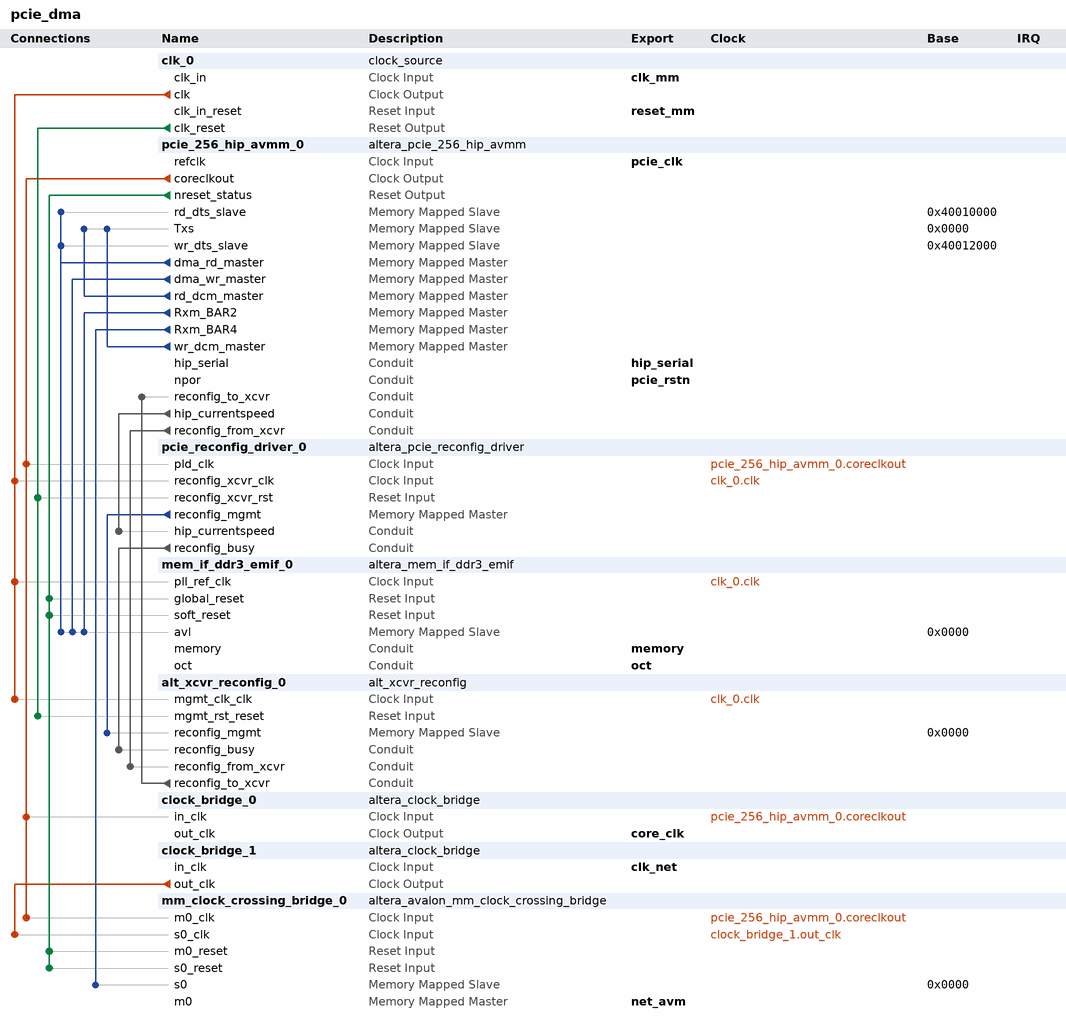
[diagram p0: system contents]
# Platform Designer (Qsys) system pcie_dma, Stratix V 5SGXEA7N2F45C2
# Parameters at their usual value, and those the tool derives, are not listed.
package require -exact qsys 14.0
create_system pcie_dma
set_project_property DEVICE_FAMILY {Stratix V}
set_project_property DEVICE 5SGXEA7N2F45C2

add_instance clk_0 clock_source 14.0
set_instance_parameter_value clk_0 clockFrequency 50000000

add_instance pcie_256_hip_avmm_0 altera_pcie_256_hip_avmm 14.0
set_instance_parameter_value pcie_256_hip_avmm_0 pcie_qsys 1
set_instance_parameter_value pcie_256_hip_avmm_0 lane_mask_hwtcl x8
set_instance_parameter_value pcie_256_hip_avmm_0 gen123_lane_rate_mode_hwtcl {Gen2 (5.0 Gbps)}
set_instance_parameter_value pcie_256_hip_avmm_0 app_interface_width_hwtcl 128
set_instance_parameter_value pcie_256_hip_avmm_0 port_type_hwtcl {Native endpoint}
set_instance_parameter_value pcie_256_hip_avmm_0 rxbuffer_rxreq_hwtcl Low
set_instance_parameter_value pcie_256_hip_avmm_0 pll_refclk_freq_hwtcl {100 MHz}
set_instance_parameter_value pcie_256_hip_avmm_0 set_pld_clk_x1_625MHz_hwtcl 0
set_instance_parameter_value pcie_256_hip_avmm_0 internal_controller_hwtcl 1
set_instance_parameter_value pcie_256_hip_avmm_0 enable_cra_hwtcl 1
set_instance_parameter_value pcie_256_hip_avmm_0 enable_rxm_burst_hwtcl 0
set_instance_parameter_value pcie_256_hip_avmm_0 in_cvp_mode_hwtcl 0
set_instance_parameter_value pcie_256_hip_avmm_0 enable_tl_only_sim_hwtcl 0
set_instance_parameter_value pcie_256_hip_avmm_0 use_atx_pll_hwtcl 0
set_instance_parameter_value pcie_256_hip_avmm_0 hip_tag_checking_hwtcl 1
set_instance_parameter_value pcie_256_hip_avmm_0 enable_power_on_rst_pulse_hwtcl 0
set_instance_parameter_value pcie_256_hip_avmm_0 enable_pcisigtest_hwtcl 0
set_instance_parameter_value pcie_256_hip_avmm_0 SLAVE_ADDRESS_MAP_0 0
set_instance_parameter_value pcie_256_hip_avmm_0 SLAVE_ADDRESS_MAP_1 0
set_instance_parameter_value pcie_256_hip_avmm_0 SLAVE_ADDRESS_MAP_2 30
set_instance_parameter_value pcie_256_hip_avmm_0 SLAVE_ADDRESS_MAP_3 0
set_instance_parameter_value pcie_256_hip_avmm_0 SLAVE_ADDRESS_MAP_4 26
set_instance_parameter_value pcie_256_hip_avmm_0 SLAVE_ADDRESS_MAP_5 0
set_instance_parameter_value pcie_256_hip_avmm_0 RD_SLAVE_ADDRESS_MAP 31
set_instance_parameter_value pcie_256_hip_avmm_0 WR_SLAVE_ADDRESS_MAP 30
set_instance_parameter_value pcie_256_hip_avmm_0 NUM_PREFETCH_MASTERS 1
set_instance_parameter_value pcie_256_hip_avmm_0 bar0_type_hwtcl 64
set_instance_parameter_value pcie_256_hip_avmm_0 bar1_type_hwtcl 1
set_instance_parameter_value pcie_256_hip_avmm_0 bar2_type_hwtcl 64
set_instance_parameter_value pcie_256_hip_avmm_0 bar3_type_hwtcl 1
set_instance_parameter_value pcie_256_hip_avmm_0 bar4_type_hwtcl 32
set_instance_parameter_value pcie_256_hip_avmm_0 bar5_type_hwtcl 1
set_instance_parameter_value pcie_256_hip_avmm_0 CB_P2A_AVALON_ADDR_B0 0x00000000
set_instance_parameter_value pcie_256_hip_avmm_0 CB_P2A_AVALON_ADDR_B1 0x00000000
set_instance_parameter_value pcie_256_hip_avmm_0 CB_P2A_AVALON_ADDR_B2 0x00000000
set_instance_parameter_value pcie_256_hip_avmm_0 CB_P2A_AVALON_ADDR_B3 0x00000000
set_instance_parameter_value pcie_256_hip_avmm_0 CB_P2A_AVALON_ADDR_B4 0x00000000
set_instance_parameter_value pcie_256_hip_avmm_0 CB_P2A_AVALON_ADDR_B5 0x00000000
set_instance_parameter_value pcie_256_hip_avmm_0 fixed_address_mode 0
set_instance_parameter_value pcie_256_hip_avmm_0 CB_P2A_FIXED_AVALON_ADDR_B0 0
set_instance_parameter_value pcie_256_hip_avmm_0 CB_P2A_FIXED_AVALON_ADDR_B1 0
set_instance_parameter_value pcie_256_hip_avmm_0 CB_P2A_FIXED_AVALON_ADDR_B2 0
set_instance_parameter_value pcie_256_hip_avmm_0 CB_P2A_FIXED_AVALON_ADDR_B3 0
set_instance_parameter_value pcie_256_hip_avmm_0 CB_P2A_FIXED_AVALON_ADDR_B4 0
set_instance_parameter_value pcie_256_hip_avmm_0 CB_P2A_FIXED_AVALON_ADDR_B5 0
set_instance_parameter_value pcie_256_hip_avmm_0 vendor_id_hwtcl 4466
set_instance_parameter_value pcie_256_hip_avmm_0 device_id_hwtcl 57347
set_instance_parameter_value pcie_256_hip_avmm_0 revision_id_hwtcl 1
set_instance_parameter_value pcie_256_hip_avmm_0 class_code_hwtcl 0
set_instance_parameter_value pcie_256_hip_avmm_0 subsystem_vendor_id_hwtcl 0
set_instance_parameter_value pcie_256_hip_avmm_0 subsystem_device_id_hwtcl 10337
set_instance_parameter_value pcie_256_hip_avmm_0 max_payload_size_hwtcl 256
set_instance_parameter_value pcie_256_hip_avmm_0 extend_tag_field_hwtcl 32
set_instance_parameter_value pcie_256_hip_avmm_0 completion_timeout_hwtcl NONE
set_instance_parameter_value pcie_256_hip_avmm_0 enable_completion_timeout_disable_hwtcl 1
set_instance_parameter_value pcie_256_hip_avmm_0 use_aer_hwtcl 0
set_instance_parameter_value pcie_256_hip_avmm_0 ecrc_check_capable_hwtcl 0
set_instance_parameter_value pcie_256_hip_avmm_0 ecrc_gen_capable_hwtcl 0
set_instance_parameter_value pcie_256_hip_avmm_0 use_crc_forwarding_hwtcl 0
set_instance_parameter_value pcie_256_hip_avmm_0 port_link_number_hwtcl 1
set_instance_parameter_value pcie_256_hip_avmm_0 dll_active_report_support_hwtcl 0
set_instance_parameter_value pcie_256_hip_avmm_0 surprise_down_error_support_hwtcl 0
set_instance_parameter_value pcie_256_hip_avmm_0 slotclkcfg_hwtcl 1
set_instance_parameter_value pcie_256_hip_avmm_0 msi_multi_message_capable_hwtcl 1
set_instance_parameter_value pcie_256_hip_avmm_0 msi_64bit_addressing_capable_hwtcl true
set_instance_parameter_value pcie_256_hip_avmm_0 msi_masking_capable_hwtcl false
set_instance_parameter_value pcie_256_hip_avmm_0 msi_support_hwtcl true
set_instance_parameter_value pcie_256_hip_avmm_0 enable_function_msix_support_hwtcl 0
set_instance_parameter_value pcie_256_hip_avmm_0 msix_table_size_hwtcl 0
set_instance_parameter_value pcie_256_hip_avmm_0 msix_table_offset_hwtcl 0
set_instance_parameter_value pcie_256_hip_avmm_0 msix_table_bir_hwtcl 0
set_instance_parameter_value pcie_256_hip_avmm_0 msix_pba_offset_hwtcl 0
set_instance_parameter_value pcie_256_hip_avmm_0 msix_pba_bir_hwtcl 0
set_instance_parameter_value pcie_256_hip_avmm_0 enable_slot_register_hwtcl 0
set_instance_parameter_value pcie_256_hip_avmm_0 slot_power_scale_hwtcl 0
set_instance_parameter_value pcie_256_hip_avmm_0 slot_power_limit_hwtcl 0
set_instance_parameter_value pcie_256_hip_avmm_0 slot_number_hwtcl 0
set_instance_parameter_value pcie_256_hip_avmm_0 endpoint_l0_latency_hwtcl 0
set_instance_parameter_value pcie_256_hip_avmm_0 endpoint_l1_latency_hwtcl 0
set_instance_parameter_value pcie_256_hip_avmm_0 CG_COMMON_CLOCK_MODE 1
set_instance_parameter_value pcie_256_hip_avmm_0 avmm_width_hwtcl 256
set_instance_parameter_value pcie_256_hip_avmm_0 CG_RXM_IRQ_NUM 16
set_instance_parameter_value pcie_256_hip_avmm_0 TX_S_ADDR_WIDTH 64
set_instance_parameter_value pcie_256_hip_avmm_0 generate_sdc_for_qsys_design_example 0
set_instance_parameter_value pcie_256_hip_avmm_0 use_rx_st_be_hwtcl 0
set_instance_parameter_value pcie_256_hip_avmm_0 use_ast_parity 0
set_instance_parameter_value pcie_256_hip_avmm_0 add_pll_to_hip_coreclkout 0
set_instance_parameter_value pcie_256_hip_avmm_0 set_pll_coreclkout_slack 10
set_instance_parameter_value pcie_256_hip_avmm_0 hip_reconfig_hwtcl 0
set_instance_parameter_value pcie_256_hip_avmm_0 vsec_id_hwtcl 40960
set_instance_parameter_value pcie_256_hip_avmm_0 vsec_rev_hwtcl 0
set_instance_parameter_value pcie_256_hip_avmm_0 expansion_base_address_register_hwtcl 0
set_instance_parameter_value pcie_256_hip_avmm_0 io_window_addr_width_hwtcl 0
set_instance_parameter_value pcie_256_hip_avmm_0 prefetchable_mem_window_addr_width_hwtcl 0
set_instance_parameter_value pcie_256_hip_avmm_0 advanced_default_parameter_override 0
set_instance_parameter_value pcie_256_hip_avmm_0 override_tbpartner_driver_setting_hwtcl 0
set_instance_parameter_value pcie_256_hip_avmm_0 override_rxbuffer_cred_preset 0
set_instance_parameter_value pcie_256_hip_avmm_0 gen3_rxfreqlock_counter_hwtcl 0
set_instance_parameter_value pcie_256_hip_avmm_0 force_hrc 0
set_instance_parameter_value pcie_256_hip_avmm_0 force_src 0
set_instance_parameter_value pcie_256_hip_avmm_0 serial_sim_hwtcl 1
set_instance_parameter_value pcie_256_hip_avmm_0 advanced_default_hwtcl_bypass_cdc false
set_instance_parameter_value pcie_256_hip_avmm_0 advanced_default_hwtcl_enable_rx_buffer_checking false
set_instance_parameter_value pcie_256_hip_avmm_0 advanced_default_hwtcl_disable_link_x2_support false
set_instance_parameter_value pcie_256_hip_avmm_0 advanced_default_hwtcl_wrong_device_id disable
set_instance_parameter_value pcie_256_hip_avmm_0 advanced_default_hwtcl_data_pack_rx disable
set_instance_parameter_value pcie_256_hip_avmm_0 advanced_default_hwtcl_ltssm_1ms_timeout disable
set_instance_parameter_value pcie_256_hip_avmm_0 advanced_default_hwtcl_ltssm_freqlocked_check disable
set_instance_parameter_value pcie_256_hip_avmm_0 advanced_default_hwtcl_deskew_comma com_deskw
set_instance_parameter_value pcie_256_hip_avmm_0 advanced_default_hwtcl_device_number 0
set_instance_parameter_value pcie_256_hip_avmm_0 advanced_default_hwtcl_pipex1_debug_sel disable
set_instance_parameter_value pcie_256_hip_avmm_0 advanced_default_hwtcl_pclk_out_sel pclk
set_instance_parameter_value pcie_256_hip_avmm_0 advanced_default_hwtcl_no_soft_reset false
set_instance_parameter_value pcie_256_hip_avmm_0 advanced_default_hwtcl_maximum_current 0
set_instance_parameter_value pcie_256_hip_avmm_0 advanced_default_hwtcl_d1_support false
set_instance_parameter_value pcie_256_hip_avmm_0 advanced_default_hwtcl_d2_support false
set_instance_parameter_value pcie_256_hip_avmm_0 advanced_default_hwtcl_d0_pme false
set_instance_parameter_value pcie_256_hip_avmm_0 advanced_default_hwtcl_d1_pme false
set_instance_parameter_value pcie_256_hip_avmm_0 advanced_default_hwtcl_d2_pme false
set_instance_parameter_value pcie_256_hip_avmm_0 advanced_default_hwtcl_d3_hot_pme false
set_instance_parameter_value pcie_256_hip_avmm_0 advanced_default_hwtcl_d3_cold_pme false
set_instance_parameter_value pcie_256_hip_avmm_0 advanced_default_hwtcl_low_priority_vc single_vc
set_instance_parameter_value pcie_256_hip_avmm_0 advanced_default_hwtcl_disable_snoop_packet false
set_instance_parameter_value pcie_256_hip_avmm_0 advanced_default_hwtcl_enable_l1_aspm false
set_instance_parameter_value pcie_256_hip_avmm_0 advanced_default_hwtcl_set_l0s 0
set_instance_parameter_value pcie_256_hip_avmm_0 advanced_default_hwtcl_l1_exit_latency_sameclock 0
set_instance_parameter_value pcie_256_hip_avmm_0 advanced_default_hwtcl_l1_exit_latency_diffclock 0
set_instance_parameter_value pcie_256_hip_avmm_0 advanced_default_hwtcl_hot_plug_support 0
set_instance_parameter_value pcie_256_hip_avmm_0 advanced_default_hwtcl_extended_tag_reset false
set_instance_parameter_value pcie_256_hip_avmm_0 advanced_default_hwtcl_no_command_completed false
set_instance_parameter_value pcie_256_hip_avmm_0 advanced_default_hwtcl_interrupt_pin inta
set_instance_parameter_value pcie_256_hip_avmm_0 advanced_default_hwtcl_bridge_port_vga_enable false
set_instance_parameter_value pcie_256_hip_avmm_0 advanced_default_hwtcl_bridge_port_ssid_support false
set_instance_parameter_value pcie_256_hip_avmm_0 advanced_default_hwtcl_ssvid 0
set_instance_parameter_value pcie_256_hip_avmm_0 advanced_default_hwtcl_ssid 0
set_instance_parameter_value pcie_256_hip_avmm_0 advanced_default_hwtcl_eie_before_nfts_count 4
set_instance_parameter_value pcie_256_hip_avmm_0 advanced_default_hwtcl_gen2_diffclock_nfts_count 255
set_instance_parameter_value pcie_256_hip_avmm_0 advanced_default_hwtcl_gen2_sameclock_nfts_count 255
set_instance_parameter_value pcie_256_hip_avmm_0 advanced_default_hwtcl_l0_exit_latency_sameclock 6
set_instance_parameter_value pcie_256_hip_avmm_0 advanced_default_hwtcl_l0_exit_latency_diffclock 6
set_instance_parameter_value pcie_256_hip_avmm_0 advanced_default_hwtcl_atomic_op_routing false
set_instance_parameter_value pcie_256_hip_avmm_0 advanced_default_hwtcl_atomic_op_completer_32bit false
set_instance_parameter_value pcie_256_hip_avmm_0 advanced_default_hwtcl_atomic_op_completer_64bit false
set_instance_parameter_value pcie_256_hip_avmm_0 advanced_default_hwtcl_cas_completer_128bit false
set_instance_parameter_value pcie_256_hip_avmm_0 advanced_default_hwtcl_ltr_mechanism false
set_instance_parameter_value pcie_256_hip_avmm_0 advanced_default_hwtcl_tph_completer false
set_instance_parameter_value pcie_256_hip_avmm_0 advanced_default_hwtcl_extended_format_field false
set_instance_parameter_value pcie_256_hip_avmm_0 advanced_default_hwtcl_atomic_malformed true
set_instance_parameter_value pcie_256_hip_avmm_0 advanced_default_hwtcl_flr_capability false
set_instance_parameter_value pcie_256_hip_avmm_0 advanced_default_hwtcl_enable_adapter_half_rate_mode false
set_instance_parameter_value pcie_256_hip_avmm_0 advanced_default_hwtcl_vc0_clk_enable true
set_instance_parameter_value pcie_256_hip_avmm_0 advanced_default_hwtcl_register_pipe_signals false
set_instance_parameter_value pcie_256_hip_avmm_0 advanced_default_hwtcl_skp_os_gen3_count 0
set_instance_parameter_value pcie_256_hip_avmm_0 advanced_default_hwtcl_tx_cdc_almost_empty 5
set_instance_parameter_value pcie_256_hip_avmm_0 advanced_default_hwtcl_rx_l0s_count_idl 0
set_instance_parameter_value pcie_256_hip_avmm_0 advanced_default_hwtcl_cdc_dummy_insert_limit 11
set_instance_parameter_value pcie_256_hip_avmm_0 advanced_default_hwtcl_ei_delay_powerdown_count 10
set_instance_parameter_value pcie_256_hip_avmm_0 advanced_default_hwtcl_skp_os_schedule_count 0
set_instance_parameter_value pcie_256_hip_avmm_0 advanced_default_hwtcl_fc_init_timer 1024
set_instance_parameter_value pcie_256_hip_avmm_0 advanced_default_hwtcl_l01_entry_latency 31
set_instance_parameter_value pcie_256_hip_avmm_0 advanced_default_hwtcl_flow_control_update_count 30
set_instance_parameter_value pcie_256_hip_avmm_0 advanced_default_hwtcl_flow_control_timeout_count 200
set_instance_parameter_value pcie_256_hip_avmm_0 advanced_default_hwtcl_retry_buffer_last_active_address 2047
set_instance_parameter_value pcie_256_hip_avmm_0 advanced_default_hwtcl_reserved_debug 0
set_instance_parameter_value pcie_256_hip_avmm_0 altpcie_avmm_hwtcl 1
set_instance_parameter_value pcie_256_hip_avmm_0 enable_rx_buffer_checking_advanced_default_hwtcl false
set_instance_parameter_value pcie_256_hip_avmm_0 disable_link_x2_support_advanced_default_hwtcl false
set_instance_parameter_value pcie_256_hip_avmm_0 device_number_advanced_default_hwtcl 0
set_instance_parameter_value pcie_256_hip_avmm_0 pipex1_debug_sel_advanced_default_hwtcl disable
set_instance_parameter_value pcie_256_hip_avmm_0 pclk_out_sel_advanced_default_hwtcl pclk
set_instance_parameter_value pcie_256_hip_avmm_0 no_soft_reset_advanced_default_hwtcl false
set_instance_parameter_value pcie_256_hip_avmm_0 d1_support_advanced_default_hwtcl false
set_instance_parameter_value pcie_256_hip_avmm_0 d2_support_advanced_default_hwtcl false
set_instance_parameter_value pcie_256_hip_avmm_0 d0_pme_advanced_default_hwtcl false
set_instance_parameter_value pcie_256_hip_avmm_0 d1_pme_advanced_default_hwtcl false
set_instance_parameter_value pcie_256_hip_avmm_0 d2_pme_advanced_default_hwtcl false
set_instance_parameter_value pcie_256_hip_avmm_0 d3_hot_pme_advanced_default_hwtcl false
set_instance_parameter_value pcie_256_hip_avmm_0 d3_cold_pme_advanced_default_hwtcl false
set_instance_parameter_value pcie_256_hip_avmm_0 low_priority_vc_advanced_default_hwtcl single_vc
set_instance_parameter_value pcie_256_hip_avmm_0 enable_l1_aspm_advanced_default_hwtcl false
set_instance_parameter_value pcie_256_hip_avmm_0 l1_exit_latency_sameclock_advanced_default_hwtcl 0
set_instance_parameter_value pcie_256_hip_avmm_0 l1_exit_latency_diffclock_advanced_default_hwtcl 0
set_instance_parameter_value pcie_256_hip_avmm_0 hot_plug_support_advanced_default_hwtcl 0
set_instance_parameter_value pcie_256_hip_avmm_0 no_command_completed_advanced_default_hwtcl false
set_instance_parameter_value pcie_256_hip_avmm_0 eie_before_nfts_count_advanced_default_hwtcl 4
set_instance_parameter_value pcie_256_hip_avmm_0 gen2_diffclock_nfts_count_advanced_default_hwtcl 255
set_instance_parameter_value pcie_256_hip_avmm_0 gen2_sameclock_nfts_count_advanced_default_hwtcl 255
set_instance_parameter_value pcie_256_hip_avmm_0 deemphasis_enable_advanced_default_hwtcl false
set_instance_parameter_value pcie_256_hip_avmm_0 l0_exit_latency_sameclock_advanced_default_hwtcl 6
set_instance_parameter_value pcie_256_hip_avmm_0 l0_exit_latency_diffclock_advanced_default_hwtcl 6
set_instance_parameter_value pcie_256_hip_avmm_0 vc0_clk_enable_advanced_default_hwtcl true
set_instance_parameter_value pcie_256_hip_avmm_0 register_pipe_signals_advanced_default_hwtcl true
set_instance_parameter_value pcie_256_hip_avmm_0 tx_cdc_almost_empty_advanced_default_hwtcl 5
set_instance_parameter_value pcie_256_hip_avmm_0 rx_l0s_count_idl_advanced_default_hwtcl 0
set_instance_parameter_value pcie_256_hip_avmm_0 cdc_dummy_insert_limit_advanced_default_hwtcl 11
set_instance_parameter_value pcie_256_hip_avmm_0 ei_delay_powerdown_count_advanced_default_hwtcl 10
set_instance_parameter_value pcie_256_hip_avmm_0 skp_os_schedule_count_advanced_default_hwtcl 0
set_instance_parameter_value pcie_256_hip_avmm_0 fc_init_timer_advanced_default_hwtcl 1024
set_instance_parameter_value pcie_256_hip_avmm_0 l01_entry_latency_advanced_default_hwtcl 31
set_instance_parameter_value pcie_256_hip_avmm_0 flow_control_update_count_advanced_default_hwtcl 30
set_instance_parameter_value pcie_256_hip_avmm_0 flow_control_timeout_count_advanced_default_hwtcl 200
set_instance_parameter_value pcie_256_hip_avmm_0 retry_buffer_last_active_address_advanced_default_hwtcl 255
set_instance_parameter_value pcie_256_hip_avmm_0 reserved_debug_advanced_default_hwtcl 0
set_instance_parameter_value pcie_256_hip_avmm_0 use_tl_cfg_sync_advanced_default_hwtcl 1
set_instance_parameter_value pcie_256_hip_avmm_0 diffclock_nfts_count_advanced_default_hwtcl 255
set_instance_parameter_value pcie_256_hip_avmm_0 sameclock_nfts_count_advanced_default_hwtcl 255
set_instance_parameter_value pcie_256_hip_avmm_0 l2_async_logic_advanced_default_hwtcl disable
set_instance_parameter_value pcie_256_hip_avmm_0 rx_cdc_almost_full_advanced_default_hwtcl 12
set_instance_parameter_value pcie_256_hip_avmm_0 tx_cdc_almost_full_advanced_default_hwtcl 11
set_instance_parameter_value pcie_256_hip_avmm_0 indicator_advanced_default_hwtcl 0
set_instance_parameter_value pcie_256_hip_avmm_0 hwtcl_override_g2_txvod 1
set_instance_parameter_value pcie_256_hip_avmm_0 rpre_emph_a_val_hwtcl 9
set_instance_parameter_value pcie_256_hip_avmm_0 rpre_emph_b_val_hwtcl 0
set_instance_parameter_value pcie_256_hip_avmm_0 rpre_emph_c_val_hwtcl 16
set_instance_parameter_value pcie_256_hip_avmm_0 rpre_emph_d_val_hwtcl 13
set_instance_parameter_value pcie_256_hip_avmm_0 rpre_emph_e_val_hwtcl 5
set_instance_parameter_value pcie_256_hip_avmm_0 rvod_sel_a_val_hwtcl 42
set_instance_parameter_value pcie_256_hip_avmm_0 rvod_sel_b_val_hwtcl 38
set_instance_parameter_value pcie_256_hip_avmm_0 rvod_sel_c_val_hwtcl 38
set_instance_parameter_value pcie_256_hip_avmm_0 rvod_sel_d_val_hwtcl 43
set_instance_parameter_value pcie_256_hip_avmm_0 rvod_sel_e_val_hwtcl 15
set_instance_parameter_value pcie_256_hip_avmm_0 av_rpre_emph_a_val_hwtcl 12
set_instance_parameter_value pcie_256_hip_avmm_0 av_rpre_emph_b_val_hwtcl 0
set_instance_parameter_value pcie_256_hip_avmm_0 av_rpre_emph_c_val_hwtcl 19
set_instance_parameter_value pcie_256_hip_avmm_0 av_rpre_emph_d_val_hwtcl 13
set_instance_parameter_value pcie_256_hip_avmm_0 av_rpre_emph_e_val_hwtcl 21
set_instance_parameter_value pcie_256_hip_avmm_0 av_rvod_sel_a_val_hwtcl 42
set_instance_parameter_value pcie_256_hip_avmm_0 av_rvod_sel_b_val_hwtcl 30
set_instance_parameter_value pcie_256_hip_avmm_0 av_rvod_sel_c_val_hwtcl 43
set_instance_parameter_value pcie_256_hip_avmm_0 av_rvod_sel_d_val_hwtcl 43
set_instance_parameter_value pcie_256_hip_avmm_0 av_rvod_sel_e_val_hwtcl 9
set_instance_parameter_value pcie_256_hip_avmm_0 cv_rpre_emph_a_val_hwtcl 11
set_instance_parameter_value pcie_256_hip_avmm_0 cv_rpre_emph_b_val_hwtcl 0
set_instance_parameter_value pcie_256_hip_avmm_0 cv_rpre_emph_c_val_hwtcl 22
set_instance_parameter_value pcie_256_hip_avmm_0 cv_rpre_emph_d_val_hwtcl 12
set_instance_parameter_value pcie_256_hip_avmm_0 cv_rpre_emph_e_val_hwtcl 21
set_instance_parameter_value pcie_256_hip_avmm_0 cv_rvod_sel_a_val_hwtcl 50
set_instance_parameter_value pcie_256_hip_avmm_0 cv_rvod_sel_b_val_hwtcl 34
set_instance_parameter_value pcie_256_hip_avmm_0 cv_rvod_sel_c_val_hwtcl 50
set_instance_parameter_value pcie_256_hip_avmm_0 cv_rvod_sel_d_val_hwtcl 50
set_instance_parameter_value pcie_256_hip_avmm_0 cv_rvod_sel_e_val_hwtcl 9

add_instance pcie_reconfig_driver_0 altera_pcie_reconfig_driver 14.0
set_instance_parameter_value pcie_reconfig_driver_0 gen123_lane_rate_mode_hwtcl {Gen2 (5.0 Gbps)}
set_instance_parameter_value pcie_reconfig_driver_0 number_of_reconfig_interfaces 10

add_instance mem_if_ddr3_emif_0 altera_mem_if_ddr3_emif 14.0
set_instance_parameter_value mem_if_ddr3_emif_0 MEM_VENDOR Micron
set_instance_parameter_value mem_if_ddr3_emif_0 MEM_FORMAT UNBUFFERED
set_instance_parameter_value mem_if_ddr3_emif_0 MEM_CLK_FREQ_MAX 800.0
set_instance_parameter_value mem_if_ddr3_emif_0 MEM_ROW_ADDR_WIDTH 14
set_instance_parameter_value mem_if_ddr3_emif_0 MEM_COL_ADDR_WIDTH 10
set_instance_parameter_value mem_if_ddr3_emif_0 MEM_DQ_WIDTH 64
set_instance_parameter_value mem_if_ddr3_emif_0 MEM_BANKADDR_WIDTH 3
set_instance_parameter_value mem_if_ddr3_emif_0 MEM_WTCL 8
set_instance_parameter_value mem_if_ddr3_emif_0 MEM_TCL 11
set_instance_parameter_value mem_if_ddr3_emif_0 TIMING_TIS 170
set_instance_parameter_value mem_if_ddr3_emif_0 TIMING_TIH 120
set_instance_parameter_value mem_if_ddr3_emif_0 TIMING_TDS 10
set_instance_parameter_value mem_if_ddr3_emif_0 TIMING_TDH 45
set_instance_parameter_value mem_if_ddr3_emif_0 TIMING_TDQSQ 100
set_instance_parameter_value mem_if_ddr3_emif_0 TIMING_TDQSCK 255
set_instance_parameter_value mem_if_ddr3_emif_0 TIMING_TDQSS 0.27
set_instance_parameter_value mem_if_ddr3_emif_0 TIMING_TQSH 0.4
set_instance_parameter_value mem_if_ddr3_emif_0 TIMING_TDSH 0.18
set_instance_parameter_value mem_if_ddr3_emif_0 TIMING_TDSS 0.18
set_instance_parameter_value mem_if_ddr3_emif_0 MEM_TRAS_NS 35.0
set_instance_parameter_value mem_if_ddr3_emif_0 MEM_TRCD_NS 13.75
set_instance_parameter_value mem_if_ddr3_emif_0 MEM_TRP_NS 13.75
set_instance_parameter_value mem_if_ddr3_emif_0 MEM_TRFC_NS 160.0
set_instance_parameter_value mem_if_ddr3_emif_0 MEM_TWTR 4
set_instance_parameter_value mem_if_ddr3_emif_0 MEM_TFAW_NS 30.0
set_instance_parameter_value mem_if_ddr3_emif_0 MEM_TRRD_NS 6.0
set_instance_parameter_value mem_if_ddr3_emif_0 MEM_TRTP_NS 7.5
set_instance_parameter_value mem_if_ddr3_emif_0 RATE Quarter
set_instance_parameter_value mem_if_ddr3_emif_0 MEM_CLK_FREQ 800.0
set_instance_parameter_value mem_if_ddr3_emif_0 SPEED_GRADE 2
set_instance_parameter_value mem_if_ddr3_emif_0 HARD_EMIF false
set_instance_parameter_value mem_if_ddr3_emif_0 POWER_OF_TWO_BUS true
set_instance_parameter_value mem_if_ddr3_emif_0 AVL_MAX_SIZE 4
set_instance_parameter_value mem_if_ddr3_emif_0 PRIORITY_PORT 1,1,1,1,1,1
set_instance_parameter_value mem_if_ddr3_emif_0 CPORT_TYPE_PORT Bidirectional,Bidirectional,Bidirectional,Bidirectional,Bidirectional,Bidirectional
set_instance_parameter_value mem_if_ddr3_emif_0 REF_CLK_FREQ 50.0
set_instance_parameter_value mem_if_ddr3_emif_0 EXPORT_AFI_HALF_CLK false
set_instance_parameter_value mem_if_ddr3_emif_0 PLL_LOCATION Top_Bottom
set_instance_parameter_value mem_if_ddr3_emif_0 CALIBRATION_MODE Skip
set_instance_parameter_value mem_if_ddr3_emif_0 USER_DEBUG_LEVEL 0
set_instance_parameter_value mem_if_ddr3_emif_0 TIMING_BOARD_MAX_CK_DELAY 1.78
set_instance_parameter_value mem_if_ddr3_emif_0 TIMING_BOARD_MAX_DQS_DELAY 0.7
set_instance_parameter_value mem_if_ddr3_emif_0 TIMING_BOARD_SKEW_CKDQS_DIMM_MIN 0.06
set_instance_parameter_value mem_if_ddr3_emif_0 TIMING_BOARD_SKEW_CKDQS_DIMM_MAX 1.29
set_instance_parameter_value mem_if_ddr3_emif_0 TIMING_BOARD_SKEW_WITHIN_DQS 0.0090
set_instance_parameter_value mem_if_ddr3_emif_0 TIMING_BOARD_SKEW_BETWEEN_DQS 0.1
set_instance_parameter_value mem_if_ddr3_emif_0 TIMING_BOARD_DQ_TO_DQS_SKEW 0.0020
set_instance_parameter_value mem_if_ddr3_emif_0 TIMING_BOARD_AC_SKEW 0.05
set_instance_parameter_value mem_if_ddr3_emif_0 TIMING_BOARD_AC_TO_CK_SKEW 0.012

add_instance alt_xcvr_reconfig_0 alt_xcvr_reconfig 14.0
set_instance_parameter_value alt_xcvr_reconfig_0 device_family {Stratix V}
set_instance_parameter_value alt_xcvr_reconfig_0 number_of_reconfig_interfaces 10
set_instance_parameter_value alt_xcvr_reconfig_0 enable_analog 1
set_instance_parameter_value alt_xcvr_reconfig_0 enable_adce 1

add_instance clock_bridge_0 altera_clock_bridge 14.0
set_instance_parameter_value clock_bridge_0 DERIVED_CLOCK_RATE 250000000
set_instance_parameter_value clock_bridge_0 EXPLICIT_CLOCK_RATE 250000000

add_instance clock_bridge_1 altera_clock_bridge 14.0
set_instance_parameter_value clock_bridge_1 DERIVED_CLOCK_RATE 0
set_instance_parameter_value clock_bridge_1 EXPLICIT_CLOCK_RATE 250000000

add_instance mm_clock_crossing_bridge_0 altera_avalon_mm_clock_crossing_bridge 14.0
set_instance_parameter_value mm_clock_crossing_bridge_0 DATA_WIDTH 32
set_instance_parameter_value mm_clock_crossing_bridge_0 ADDRESS_WIDTH 26
set_instance_parameter_value mm_clock_crossing_bridge_0 USE_AUTO_ADDRESS_WIDTH 0
set_instance_parameter_value mm_clock_crossing_bridge_0 MAX_BURST_SIZE 1
set_instance_parameter_value mm_clock_crossing_bridge_0 COMMAND_FIFO_DEPTH 4
set_instance_parameter_value mm_clock_crossing_bridge_0 RESPONSE_FIFO_DEPTH 4
set_instance_parameter_value mm_clock_crossing_bridge_0 MASTER_SYNC_DEPTH 2
set_instance_parameter_value mm_clock_crossing_bridge_0 SLAVE_SYNC_DEPTH 2

# connections
add_connection clk_0.clk alt_xcvr_reconfig_0.mgmt_clk_clk clock
add_connection clk_0.clk mem_if_ddr3_emif_0.pll_ref_clk clock
add_connection clk_0.clk pcie_reconfig_driver_0.reconfig_xcvr_clk clock
add_connection clock_bridge_1.out_clk mm_clock_crossing_bridge_0.s0_clk clock
add_connection pcie_256_hip_avmm_0.coreclkout clock_bridge_0.in_clk clock
add_connection pcie_256_hip_avmm_0.coreclkout mm_clock_crossing_bridge_0.m0_clk clock
add_connection pcie_256_hip_avmm_0.coreclkout pcie_reconfig_driver_0.pld_clk clock
add_connection clk_0.clk_reset alt_xcvr_reconfig_0.mgmt_rst_reset reset
add_connection clk_0.clk_reset pcie_reconfig_driver_0.reconfig_xcvr_rst reset
add_connection pcie_256_hip_avmm_0.nreset_status mem_if_ddr3_emif_0.global_reset reset
add_connection pcie_256_hip_avmm_0.nreset_status mem_if_ddr3_emif_0.soft_reset reset
add_connection pcie_256_hip_avmm_0.nreset_status mm_clock_crossing_bridge_0.m0_reset reset
add_connection pcie_256_hip_avmm_0.nreset_status mm_clock_crossing_bridge_0.s0_reset reset
add_connection pcie_256_hip_avmm_0.dma_rd_master mem_if_ddr3_emif_0.avl avalon
set_connection_parameter_value pcie_256_hip_avmm_0.dma_rd_master/mem_if_ddr3_emif_0.avl baseAddress 0x0000
add_connection pcie_256_hip_avmm_0.dma_rd_master pcie_256_hip_avmm_0.rd_dts_slave avalon
set_connection_parameter_value pcie_256_hip_avmm_0.dma_rd_master/pcie_256_hip_avmm_0.rd_dts_slave baseAddress 0x40010000
add_connection pcie_256_hip_avmm_0.dma_rd_master pcie_256_hip_avmm_0.wr_dts_slave avalon
set_connection_parameter_value pcie_256_hip_avmm_0.dma_rd_master/pcie_256_hip_avmm_0.wr_dts_slave baseAddress 0x40012000
add_connection pcie_256_hip_avmm_0.dma_wr_master mem_if_ddr3_emif_0.avl avalon
set_connection_parameter_value pcie_256_hip_avmm_0.dma_wr_master/mem_if_ddr3_emif_0.avl baseAddress 0x0000
add_connection pcie_256_hip_avmm_0.rd_dcm_master pcie_256_hip_avmm_0.Txs avalon
set_connection_parameter_value pcie_256_hip_avmm_0.rd_dcm_master/pcie_256_hip_avmm_0.Txs baseAddress 0x0000
add_connection pcie_256_hip_avmm_0.Rxm_BAR2 mem_if_ddr3_emif_0.avl avalon
set_connection_parameter_value pcie_256_hip_avmm_0.Rxm_BAR2/mem_if_ddr3_emif_0.avl baseAddress 0x0000
add_connection pcie_256_hip_avmm_0.Rxm_BAR4 mm_clock_crossing_bridge_0.s0 avalon
set_connection_parameter_value pcie_256_hip_avmm_0.Rxm_BAR4/mm_clock_crossing_bridge_0.s0 baseAddress 0x0000
add_connection pcie_256_hip_avmm_0.wr_dcm_master pcie_256_hip_avmm_0.Txs avalon
set_connection_parameter_value pcie_256_hip_avmm_0.wr_dcm_master/pcie_256_hip_avmm_0.Txs baseAddress 0x0000
add_connection pcie_reconfig_driver_0.reconfig_mgmt alt_xcvr_reconfig_0.reconfig_mgmt avalon
set_connection_parameter_value pcie_reconfig_driver_0.reconfig_mgmt/alt_xcvr_reconfig_0.reconfig_mgmt baseAddress 0x0000
add_connection alt_xcvr_reconfig_0.reconfig_to_xcvr pcie_256_hip_avmm_0.reconfig_to_xcvr conduit
add_connection pcie_256_hip_avmm_0.hip_currentspeed pcie_reconfig_driver_0.hip_currentspeed conduit
add_connection pcie_256_hip_avmm_0.reconfig_from_xcvr alt_xcvr_reconfig_0.reconfig_from_xcvr conduit
add_connection pcie_reconfig_driver_0.reconfig_busy alt_xcvr_reconfig_0.reconfig_busy conduit

# exported interfaces
add_interface clk_mm clock sink
set_interface_property clk_mm EXPORT_OF clk_0.clk_in
add_interface reset_mm reset sink
set_interface_property reset_mm EXPORT_OF clk_0.clk_in_reset
add_interface memory conduit end
set_interface_property memory EXPORT_OF mem_if_ddr3_emif_0.memory
add_interface oct conduit end
set_interface_property oct EXPORT_OF mem_if_ddr3_emif_0.oct
add_interface pcie_clk clock sink
set_interface_property pcie_clk EXPORT_OF pcie_256_hip_avmm_0.refclk
add_interface pcie_rstn conduit end
set_interface_property pcie_rstn EXPORT_OF pcie_256_hip_avmm_0.npor
add_interface hip_serial conduit end
set_interface_property hip_serial EXPORT_OF pcie_256_hip_avmm_0.hip_serial
add_interface core_clk clock source
set_interface_property core_clk EXPORT_OF clock_bridge_0.out_clk
add_interface clk_net clock sink
set_interface_property clk_net EXPORT_OF clock_bridge_1.in_clk
add_interface net_avm avalon master
set_interface_property net_avm EXPORT_OF mm_clock_crossing_bridge_0.m0

set_interconnect_requirement {$system} qsys_mm.clockCrossingAdapter HANDSHAKE
set_interconnect_requirement {$system} qsys_mm.maxAdditionalLatency 1
set_interconnect_requirement {$system} qsys_mm.insertDefaultSlave FALSE

save_system pcie_dma.qsys
